# EAGLE schematic schema (EAGLE 5.12)
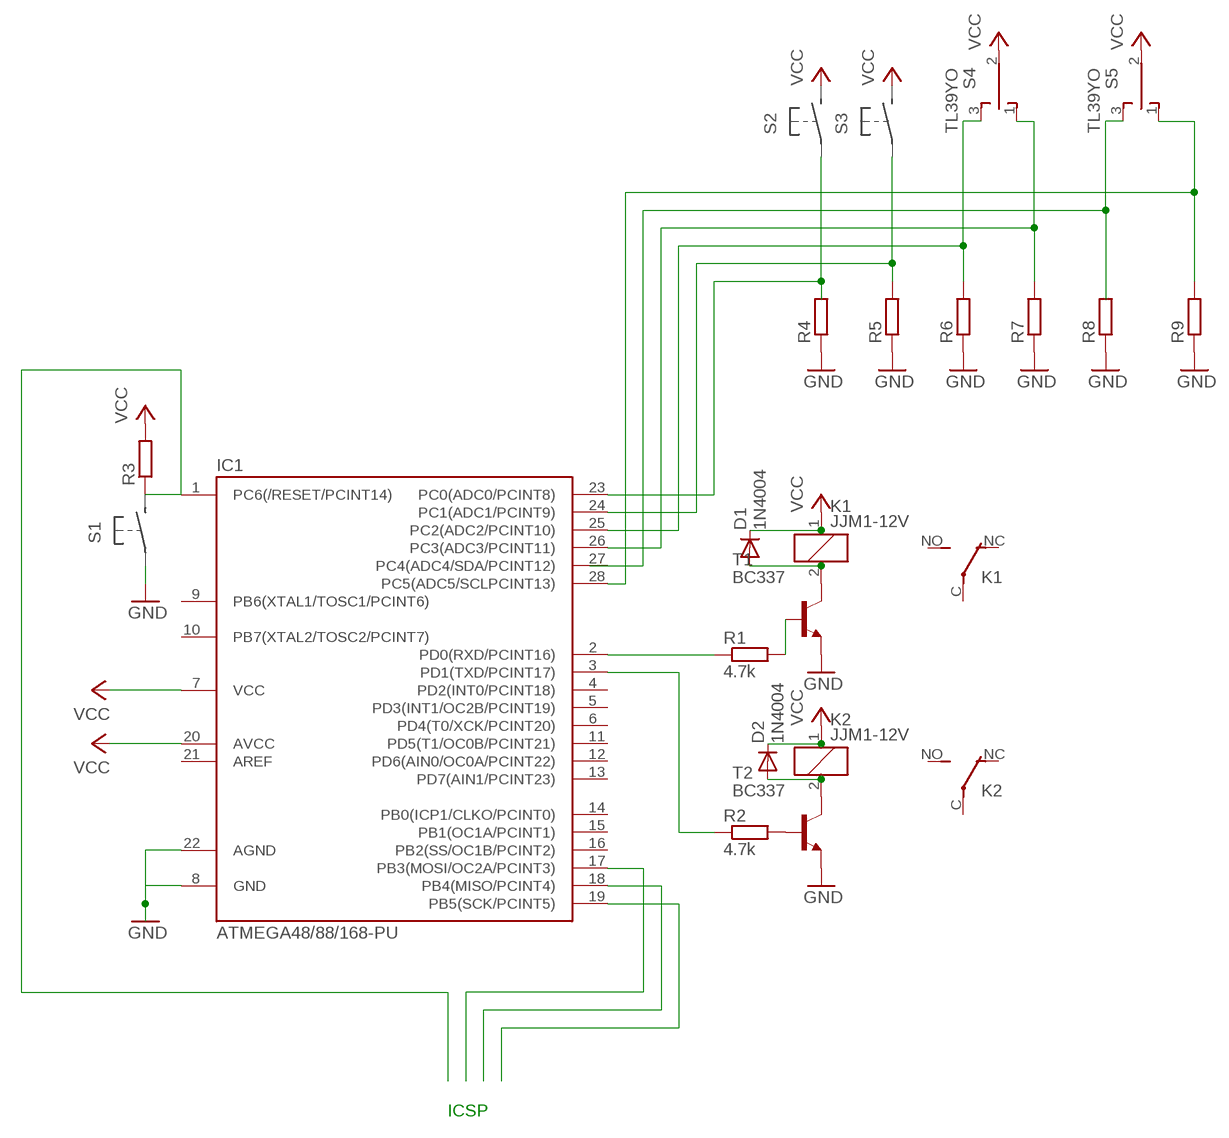
[diagram p0: schematic, sheet 1]

## Parts
D1  1N4004  [DO41-10]
D2  1N4004  [DO41-10]
IC1  ATMEGA48/88/168-PU  [DIL28-3]
K1  JJM1-12V  [JJM1C]
K2  JJM1-12V  [JJM1C]
R1  4.7k  R-EU_0207/2V  [0207/2V]
R2  4.7k  R-EU_0207/2V  [0207/2V]
R3  R-EU_0207/2V  [0207/2V]
R4  R-EU_0207/2V  [0207/2V]
R5  R-EU_0207/2V  [0207/2V]
R6  R-EU_0207/2V  [0207/2V]
R7  R-EU_0207/2V  [0207/2V]
R8  R-EU_0207/2V  [0207/2V]
R9  R-EU_0207/2V  [0207/2V]
S4  TL39YO  [TL3XYO]
S5  TL39YO  [TL3XYO]
T1  BC337  [TO92]
T2  BC337  [TO92]

## Nets
A: IC1.2(PD0(RXD/PCINT16)) R1.1
GND: R4.1 R5.1 R6.1 R7.1 R8.1 R9.1 T1.1(E) T2.1(E)
N$1: R2.1
N$2: R2.2 T2.2(B)
N$3: R1.2 T1.2(B)
N$4: K1.2 T1.3(C)
N$5: K2.2 T2.3(C)
N$6: D2.C
N$7: D2.A
N$8: D1.C
N$9: D1.A
N$10: IC1.1(PC6(/RESET/PCINT14)) R3.1
N$11: IC1.23(PC0(ADC0/PCINT8)) R4.2
N$12: IC1.24(PC1(ADC1/PCINT9)) R5.2
N$13: IC1.25(PC2(ADC2/PCINT10)) R6.2 S4.3(S)
N$14: IC1.26(PC3(ADC3/PCINT11)) R7.2 S4.1(O)
N$15: S5.3(S)
N$16: IC1.28(PC5(ADC5/SCLPCINT13)) R9.2 S5.1(O)
N$19: IC1.8(GND) IC1.22(AGND) ; supply symbol labelled GND
N$20: IC1.19(PB5(SCK/PCINT5))
N$21: IC1.18(PB4(MISO/PCINT4))
N$22: IC1.17(PB3(MOSI/OC2A/PCINT3))
VCC: IC1.7(VCC) IC1.20(AVCC) K1.1 K2.1 R3.2 S4.2(P) S5.2(P)
Unconnected: IC1.3(PD1(TXD/PCINT17)) IC1.4(PD2(INT0/PCINT18)) IC1.5(PD3(INT1/OC2B/PCINT19)) IC1.6(PD4(T0/XCK/PCINT20)) IC1.9(PB6(XTAL1/TOSC1/PCINT6)) IC1.10(PB7(XTAL2/TOSC2/PCINT7)) IC1.11(PD5(T1/OC0B/PCINT21)) IC1.12(PD6(AIN0/OC0A/PCINT22)) IC1.13(PD7(AIN1/PCINT23)) IC1.14(PB0(ICP1/CLKO/PCINT0)) IC1.15(PB1(OC1A/PCINT1)) IC1.16(PB2(SS/OC1B/PCINT2)) IC1.21(AREF) IC1.27(PC4(ADC4/SDA/PCINT12)) K1.C(2:P) K1.NC(2:O) K1.NO(2:S) K2.C(2:P) K2.NC(2:O) K2.NO(2:S) R8.2

## Notes on the sheet
- ICSP

## Library data of the parts
D1 D2 = diode:1N4004: DIODE general purpose rectifier, 1 A
IC1 = atmega48_88_168:ATMEGA48/88/168-PU
K1 K2 = relay:JJM1-12V: HALF-SIZE AUTOMOTIVE RELAY NAiS Source: http://www.mew-europe.com/.. en_ds_61210_0001.pdf; MF: AROMAT/ MATSUSHITA; MPN: JJM1-12V; OC_FARNELL: unknown; OC_NEWARK: 10C7318
R1-R9 = resistor:R-EU_: RESISTOR, European symbol
S4 S5 = switch:TL39YO: TINY SWITCH ON OFF ON Source: http://www2.produktinfo.conrad.com/datenblaetter/700000-724999/705152-da-01-de-Subminiaturschalter_TL_36YO.pdf
T1 T2 = transistor:BC337: NPN TRANSISTOR